# Altium project Salford Assignement21.PrjPcb
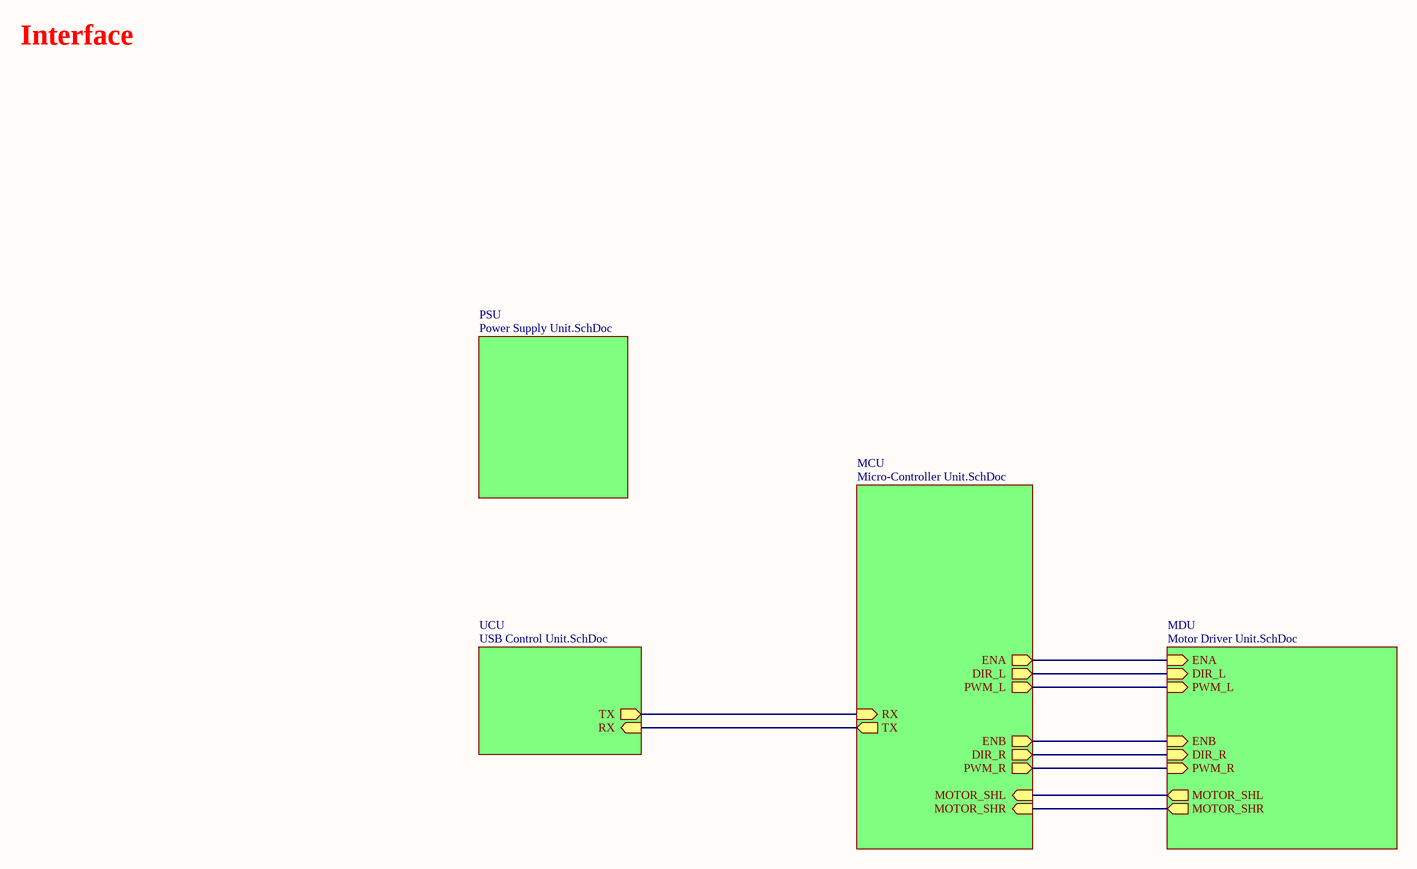
[diagram p0: Interface.SchDoc]
5 sheets, 82 parts. Net scope: hierarchical (ports join the sheet entries above them; power ports are global).
Board file: Robot Control Board.PcbDoc
Sheets:
  Interface.SchDoc
    PSU = Power Supply Unit.SchDoc
    UCU = USB Control Unit.SchDoc
    MCU = Micro-Controller Unit.SchDoc
    MDU = Motor Driver Unit.SchDoc

## Sheet Interface.SchDoc: Interface
size A3; DrawnBy: Adrien Dos SANTOS; Organization: Altium Limited; Revision: REV 1.0; SheetNumber: 1; SheetTotal: 5; ProjectName: projname

### Sub-sheets
MCU = Micro-Controller Unit.SchDoc: RX (in), TX (out), DIR_L (out), PWM_L (out), DIR_R (out), PWM_R (out), MOTOR_SHL (in), MOTOR_SHR (in), ENA (out), ENB (out)
MDU = Motor Driver Unit.SchDoc: DIR_L (in), PWM_L (in), DIR_R (in), PWM_R (in), MOTOR_SHL (out), MOTOR_SHR (out), ENA (in), ENB (in)
PSU = Power Supply Unit.SchDoc: no entries
UCU = USB Control Unit.SchDoc: TX (out), RX (in)

### Nets
NetR6_2: sheet MCU/ENA, sheet MDU/ENA
NetR7_2: sheet MCU/ENB, sheet MDU/ENB
NetR10_2: sheet MCU/MOTOR_SHL, sheet MDU/MOTOR_SHL
NetR17_2: sheet MCU/MOTOR_SHR, sheet MDU/MOTOR_SHR
NetU3_1: sheet UCU/RX, sheet MCU/TX
NetU3_5: sheet UCU/TX, sheet MCU/RX
NetU4_48: sheet MCU/DIR_R, sheet MDU/DIR_R
NetU4_49: sheet MCU/PWM_R, sheet MDU/PWM_R
NetU4_50: sheet MCU/DIR_L, sheet MDU/DIR_L
NetU4_51: sheet MCU/PWM_L, sheet MDU/PWM_L

### Notes on the sheet
- Interface
- Title
- Size:
- Date:
- A3
- Revision:
- Time:
- Sheet
- of
- Avnet EMG France SA
- 12 rue Jean Bart
- 91120 MASSY - FR
- File:
- Drawn by :

## Sheet Power Supply Unit.SchDoc: Power Supply Unit
size A3; DrawnBy: Adrien Dos SANTOS; Organization: Altium Limited; Revision: REV 1.0; SheetNumber: 4; SheetTotal: 5; ProjectName: projname
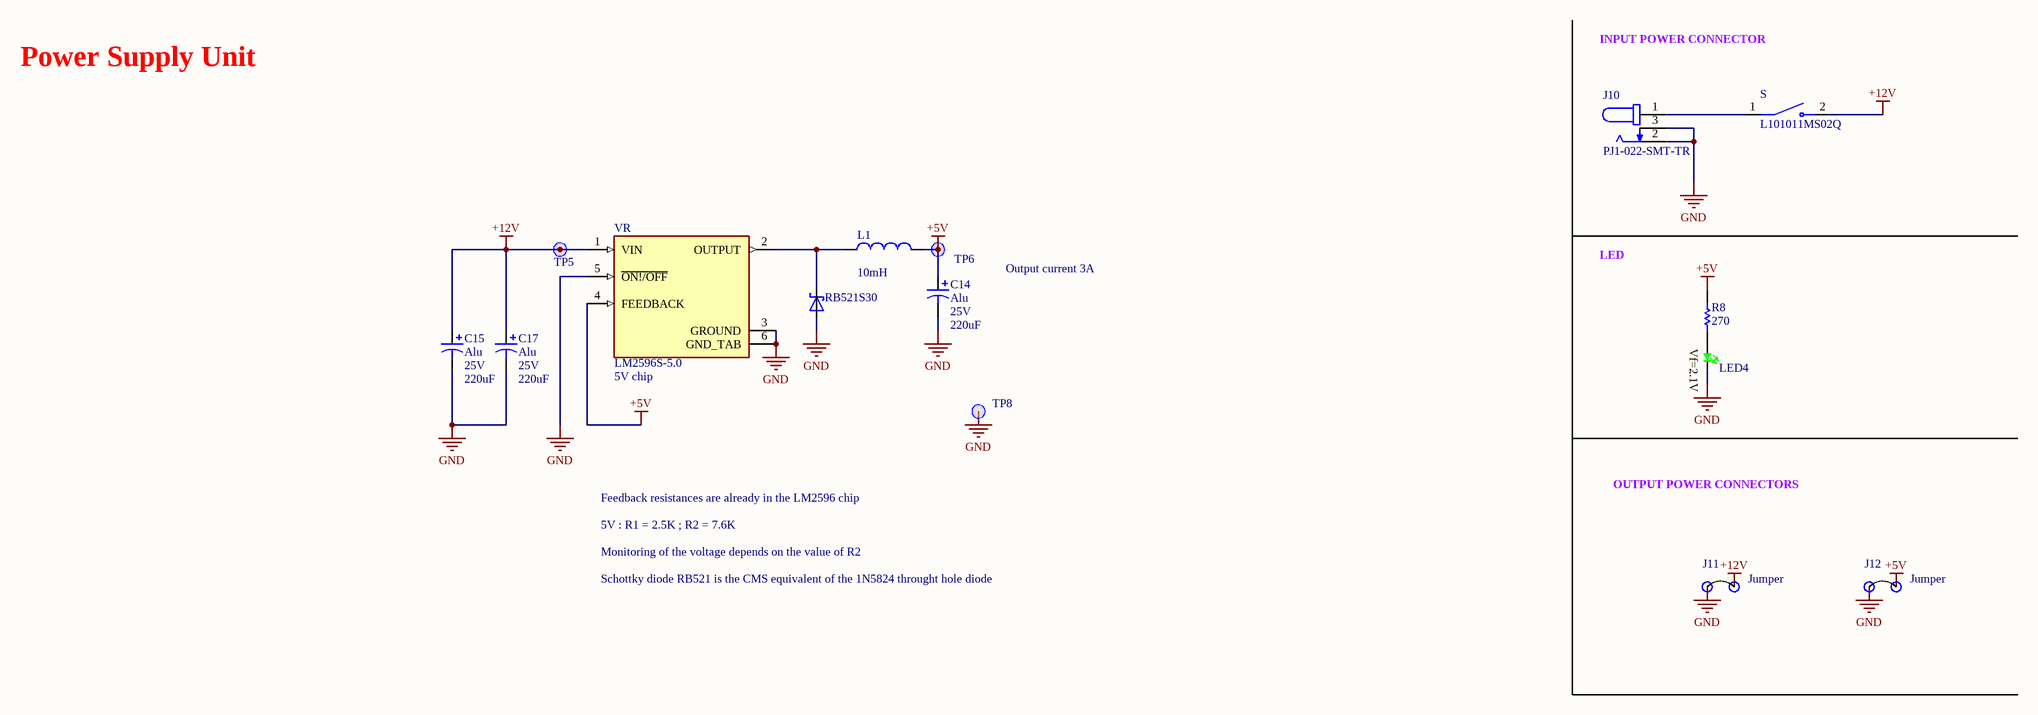
[diagram p1: Power Supply Unit.SchDoc]

### Parts
?  RB521S30  [SOD523]
C14  Alu  Voltage Rating: 25V  Capacitance: 220uF  [UUA0J471MNL1GS]
C15  Alu  Voltage Rating: 25V  Capacitance: 220uF  [UUA0J471MNL1GS]
C17  Alu  Voltage Rating: 25V  Capacitance: 220uF  [UUA0J471MNL1GS]
J10  PJ1-022-SMT-TR  [CUI_PJ1-022-SMT-TR]
J11  Jumper  [68002-102HLF]
J12  Jumper  [68002-102HLF]
L1  value 10mH  [0402-A]  (hidden comment: Inductor)
LED4  KPA-3010CGCK  [KPA-3010 GREEN]  (value not drawn)
R8  value 270  [RESC0603_N]  (hidden comment: RES)
S  L101011MS02Q  [SW_L101011MS02Q]
TP5  TEST_POINT_1.27mm  [Test_Point1.27mm]  (value not drawn)  (no BOM)
TP6  TEST_POINT_1.27mm  [Test_Point1.27mm]  (value not drawn)  (no BOM)
TP8  TEST_POINT_1.27mm  [Test_Point1.27mm]  (value not drawn)  (no BOM)
VR  LM2596S-5.0  [TO170P1524X483-6N]

### Nets
+5V: C14.1 J12.2 L1.2 R8.2 TP6.1 VR.4(FEEDBACK)
+12V: C15.1 C17.1 J11.2 S.2 TP5.1 VR.1(VIN)
GND: ?.2(A) C14.2 C15.2 C17.2 J10.2 J10.3 J11.1 J12.1 LED4.1(K) TP8.1 VR.3(GROUND) VR.5(~{ON!/OFF}) VR.6(GND_TAB)
Net?_1: ?.1(K) L1.1 VR.2(OUTPUT)
NetJ10_1: J10.1 S.1
NetLED4_2: LED4.2(A) R8.1

### Notes on the sheet
- Power Supply Unit
- INPUT POWER CONNECTOR
- Output current 3A
- LED
- (near VR) 5V chip
- Feedback resistances are already in the LM2596 chip
- OUTPUT POWER CONNECTORS
- 5V : R1 = 2.5K ; R2 = 7.6K
- Monitoring of the voltage depends on the value of R2
- Schottky diode RB521 is the CMS equivalent of the 1N5824 throught hole diode
- Title
- Size:
- Date:
- A3
- Revision:
- Time:
- Sheet
- of
- Avnet EMG France SA
- 12 rue Jean Bart
- 91120 MASSY - FR
- File:
- Drawn by :
- (in symbol KPA-3010CGCK) Vf=2.1V

### Library data of the parts
? = RB521S30: Diode Schottky 30V 200mA Surface Mount SOD-523F; MF: ON Semiconductor; Price: None; Availability: Unavailable; Package: S-9 ON Semiconductor; SnapEDA_Link: https://www.snapeda.com/parts/RB521S30/ON%20Semiconductor/view-part/1289104/?ref=snap; MP: RB521S30; Value: *
C14 C15 C17 = UUA1E221MNL1GS: CAP ALUM 220UF 20% 25V SMD; Manufacturer: Nichicon; Ripple Current: 320mA; Leakage Current: 55uA; Life (Hours): 5000Hour; Supplier 1: Digi-Key; Part Number: UUA1E221MNL1GS; Stock 1: 716; Pricing 1: 1=0,91000, 10=0,69200, 100=0,49490 (USD); RoHS: Yes; Mount: Surface Mount; Case/Package: Radial; Max Operating Temperature: 105°C; Package Quantity: 1; Tolerance: 20%; Packaging: Tape and Reel; Voltage Rating (DC): 25V; Termination: SMD/SMT; Features: General Purpose; Length: 10mm; Height - Seated (Max): 0.394inch; ComponentLink1URL: https://datasheet.ciiva.com/15036/e-ua-15036879.pdf?src-supplier=Digi-Key; ComponentLink1Description: https://datasheet.ciiva.com/15036/e-ua-15036879.pdf?src-supplier=Digi-Key; Supplier Part Number 1: 493-9451-1-ND; Currency: *; MOQ: *; Avnet part number: *
J10 = PJ1-022-SMT-TR: 0.65 x 2.8 mm, 2.5 A, Horizontal, Surface Mount _SMT_, Dc Power Jack Connector; MF: CUI Devices; SnapEDA_Link: https://www.snapeda.com/parts/PJ1-022-SMT-TR/CUI%20Devices/view-part/491023/?ref=snap; MP: PJ1-022-SMT-TR; Availability: Unavailable; Package: MSOP-8; Price: None; Value: *
J11 J12 = 68002-102HLF JMP: JUMPER Headers 2POS 2.54mm pitch for jumper; Manufacturer: Amphenol FCI; Number of Contacts: 2; Current Rating: 3A; Voltage Rating: 1.5kV; Insulation Resistance: 5GR; Gender: Male; Connector Type: Male Pin; Contact Post Length: 3.81mm; Supplier 1: Digi-Key; Part Number: 68002-102HLF; RoHS: Yes; Category: Board to Board Connectors; Stock 1: 4863; Pricing 1: 1=0,33000, 10=0,31600, 100=0,22120, 500=0,18964, 1000=0,15803, 5000=0,13545, 10000=0,12642 (USD); Mount: Through Hole; Contact Plating: Gold,GXT; Contact Material: Bronze; Color: Black; Housing Color: Black; Housing Material: Thermoplastic; Min Operating Temperature: -65°C; Max Operating Temperature: 125°C; Number of Rows: 1; Termination: Solder; Packaging: Bulk; Contact Gender: Male; Package Quantity: 100; Number of Positions: 2; Max Voltage Rating (AC): 1.5kV; Orientation: Straight; Length: 5.08mm; Pitch: 2.54mm; Contact Mating Length: 0.23inch; Depth: 2.41mm; Radiation Hardening: No; Lead Free: Lead Free; Flammability Rating: UL94 V-0; ComponentLink1URL: https://datasheet.ciiva.com/16726/68000-16726189.pdf?src-supplier=Avnet+Europe; ComponentLink1Description: https://datasheet.ciiva.com/16726/68000-16726189.pdf?src-supplier=Avnet+Europe; ComponentLink2URL: https://datasheet.ciiva.com/721/68000-721356.pdf?src-supplier=Digi-Key; ComponentLink2Description: https://datasheet.ciiva.com/721/68000-721356.pdf?src-supplier=Digi-Key
L1 = Inductor: Code_IEC: 1005; Published: 8-Jun-2000; LatestRevisionDate: 29-May-2009; LatestRevisionNote: IPC-7351 Footprint Added.; PackageReference: 0402-A; Publisher: Altium Limited; PackageDescription: Chip Inductor; Code_JEITA: 0402
LED4 = KPA-3010CGCK: 3.0 mm x 1.0 mm Green Right Angle SMD Chip LED Lamp 120°; Manufacturer: Kingbright; Part Number: APA3010CGCK; Lens Style: Clear; Dominant Wavelength: 570nm; Forward Voltage: 2.1V; Luminous Intensity: 60mcd; Test Current: 20mA; Supplier 1: Digi-Key; Stock 1: 0; Pricing 1: 2000=0.1155 (USD); Mount: Surface Mount; Case/Package: SMD/SMT; Colour: Green; Viewing Angle: 120°; Packaging: Tape and Reel; Package Quantity: 2000; Length: 3mm; Height: 1mm; Width: 2mm; Lead Free: Lead Free; Supplier Part Number 1: 754-1063-2-ND
R8 = RT0603BRE07270RL: RES 270 OHM 1/10W .1% SMD 0603; manufacturer: Yageo; currency: USD; Rated Power: 0.1W, 1/10W; smt_res_0603id: 163901; sub_category_id: 619; category_id: 33; Temperature Coefficient: ±50ppm/°C; Tolerance: ±0.1%; lead_style: Surface Mount (SMD - SMT); Value Unit: 1; MOQ: 5.000; Part Number: RT0603BRE07270RL; price: 0.11300; image: http://media.digikey.com/Renders/Yageo%20Renders/RC0603FR-0710RL_tmb.jpg; Digikey PN: RT0603BRE07270RL-ND; series: RT; composition: Thin Film; features: -; Case: 0603 (1608 metric); Size Dimension: 0.063" L x 0.031" W (1.60mm x 0.80mm); Height: 0.018" (0.45mm); packaging: Tape & Reel (TR); quantity_available: 0; datasheet: http://www.yageo.com/pdf/PYu-RT_1-to-0.05_RoHS_L_3.pdf; Normalized Value: 270; Display Value: 270; Value_in_ohm: 270
S = L101011MS02Q: Slide Switch SPST Through Hole; MF: C&K; MP: L101011MS02Q; Value: *; Availability: Unavailable; SnapEDA_Link: https://www.snapeda.com/parts/L101011MS02Q/C%26K/view-part/455586/?ref=snap; Price: None; Package: None
VR = LM2596S-5.0: SIMPLE SWITCHER&reg; 4.5V to 40V, 3A Low Component Count Step-Down Regulator 5-DDPAK/TO-263; MF: Texas Instruments; MP: LM2596S-5.0/NOPB; DigiKey-Purchase-URL: https://snapeda.com/shop?store=DigiKey&id=15588; Mouser-Purchase-URL: https://snapeda.com/shop?store=Mouser&id=15588; SnapEDA_Link: https://www.snapeda.com/parts/LM2596S-5.0/NOPB/Texas%20Instruments/view-part/15588/?ref=snap; Price: None; Value: *; Availability: Good; Texas_Instruments-Purchase-URL: https://snapeda.com/shop?store=Texas+Instruments&id=15588; Package: TO-263-5 Texas Instruments

## Sheet USB Control Unit.SchDoc: USB Control Unit
size A3; DrawnBy: Adrien Dos SANTOS; Organization: Altium Limited; Revision: REV 1.0; SheetNumber: 5; SheetTotal: 5; ProjectName: projname
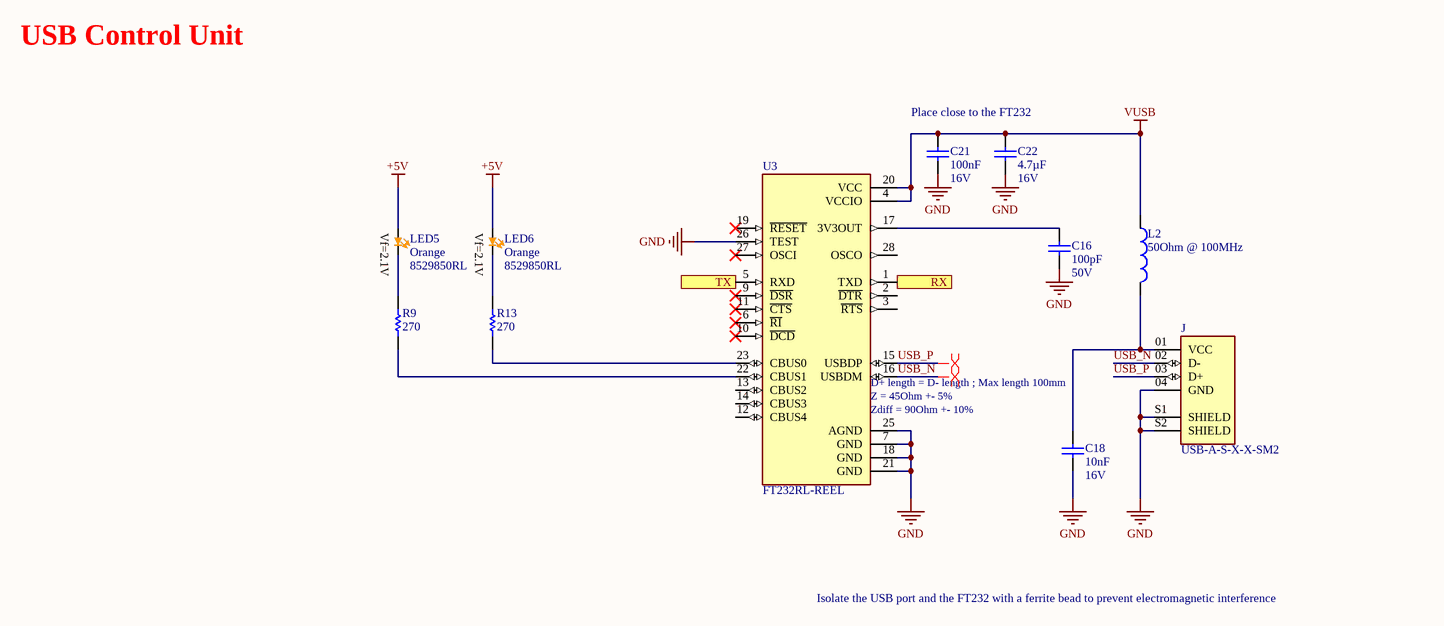
[diagram p2: USB Control Unit.SchDoc]

### Parts
C16  value 100pF  Voltage - Rated: 50V  [CC0201 x 0.33mm]  (hidden comment: CAP)
C18  value 10nF  Voltage - Rated: 16V  [CC0603 x 0.95mm]  (hidden comment: CAP)
C21  value 100nF  Voltage - Rated: 16V  [CC0603 x 0.90mm]  (hidden comment: CAP)
C22  value 4.7µF  Voltage - Rated: 16V  [CC0603 x 0.95mm]  (hidden comment: CAP)
J  USB-A-S-X-X-SM2  [SAMTEC_USB-A-S-X-X-SM2]
L2  50Ohm @ 100MHz  [MMZ1608D500CTDH5]
LED5  Orange  Supplier Part Number 1: 8529850RL  [LED 0603 ORANGE]
LED6  Orange  Supplier Part Number 1: 8529850RL  [LED 0603 ORANGE]
R9  value 270  [RESC0603_N]  (hidden comment: RES)
R13  value 270  [RESC0603_N]  (hidden comment: RES)
U3  FT232RL-REEL  [SOP65P780X200-28N]

### Ports
RX (out), TX (in)

### Nets
+5V: LED5.2(A) LED6.2(A)
GND: C16.1 C18.1 C21.1 C22.1 J.04(GND) J.S1(SHIELD) J.S2(SHIELD) U3.7(GND) U3.18(GND) U3.21(GND) U3.25(AGND) U3.26(TEST)
VUSB: C21.2 C22.2 L2.1 U3.4(VCCIO) U3.20(VCC)
USB_N: J.02(D-) U3.16(USBDM)
USB_P: J.03(D+) U3.15(USBDP)
NetC16_2: C16.2 U3.17(3V3OUT)
NetC18_2: C18.2 J.01(VCC) L2.2
NetLED5_1: LED5.1(K) R9.2
NetLED6_1: LED6.1(K) R13.2
NetR9_1: R9.1 U3.22(CBUS1)
NetR13_1: R13.1 U3.23(CBUS0)
NetU3_1: U3.1(TXD) ; port RX
NetU3_5: U3.5(RXD) ; port TX

Not connected (* = marked no-connect by the designer): U3 2(~{DTR}) 3(~{RTS}) 6(~{RI})* 9(~{DSR})* 10(~{DCD})* 11(~{CTS})* 12(CBUS4) 13(CBUS2) 14(CBUS3) 19(~{RESET})* 27(OSCI)* 28(OSCO)

### Layout directives
differential pair; differential pair class USB: USB_N, USB_P

### Notes on the sheet
- USB Control Unit
- Place close to the FT232
- (near U3) D+ length = D- length ; Max length 100mm
- (near U3) Z = 45Ohm +- 5%
- (near U3) Zdiff = 90Ohm +- 10%
- Isolate the USB port and the FT232 with a ferrite bead to prevent electromagnetic interference
- Title
- Size:
- Date:
- A3
- Revision:
- Time:
- Sheet
- of
- Avnet EMG France SA
- 12 rue Jean Bart
- 91120 MASSY - FR
- File:
- Drawn by :
- (in symbol KP-1608SECK) Vf=2.1V

### Library data of the parts
C16 = GRM0335C1H101GA01D: 100pF ±2% 50V Ceramic Capacitor C0G, NP0 0201 (0603 Metric); manufacturer: Murata Electronics; Manufacturer Standard Lead Time: 11 Weeks; currency: USD; idx: 118; Package Inch: 0201; Package Metric: 0603; Normalized value µF: 0.0001; Part Number: GRM0335C1H101GA01D; price: *; Rated Voltage: *; Tolerance: ±2%; Temperature Coefficient: C0G, NP0; MOQ: *; ComponentLink1URL: https://search.murata.co.jp/Ceramy/image/img/A01X/G101/ENG/GRM0335C1H101GA01-01.pdf; ProductLink: https://www.digikey.com/product-detail/en/murata-electronics/GRM0335C1H101GA01D/490-7751-2-ND/4358135; Digi-Key Part Number: 490-7751-2-ND; Operating Temperature: -55°C ~ 125°C; Lead Free Status / RoHS Status: Lead free / ROHS3 Compliant; Mounting Type: Surface Mount, MLCC; Size / Dimension: 0.024" L x 0.012" W (0.60mm x 0.30mm); Thickness (Max): 0.013" (0.33mm); Thickness mm: 0.33; Thickness Inch: 0.013; Length Inch: 0.024; Width Inch: 0.012; Length mm: 0.60; Width mm: 0.30; Series: GRM; Part Status: Active; Package / Case: 0201 (0603 Metric); Lead Style: -; Packaging: Tape & Reel (TR); Moisture Sensitivity Level (MSL): 1  (Unlimited); ComponentLink1Description: Datasheet; Applications: General Purpose; Height - Seated (Max): -; Lead Spacing: -; Capacitance: 100pF; Features: -; Ratings: -
C18 = CS0603KRX7R7BB103: 10000pF ±10% 16V Ceramic Capacitor X7R 0603 (1608 Metric); manufacturer: Yageo; Manufacturer Standard Lead Time: 17 Weeks; currency: USD; idx: 48811; Package Inch: 0603; Package Metric: 1608; Normalized value µF: 0.01; Part Number: CS0603KRX7R7BB103; price: *; Rated Voltage: *; Tolerance: ±10%; Temperature Coefficient: X7R; MOQ: *; ComponentLink1URL: http://www.yageo.com/NewPortal/yageodocoutput?fileName=/pdf/MLCC/UPY-ST_NPOX7R_16V-to-3KV_5.pdf; ProductLink: https://www.digikey.com/product-detail/en/yageo/CS0603KRX7R7BB103/CS0603KRX7R7BB103-ND/6097905; Digi-Key Part Number: CS0603KRX7R7BB103-ND; Operating Temperature: -55°C ~ 125°C; Lead Free Status / RoHS Status: Lead free / ROHS3 Compliant; Mounting Type: Surface Mount, MLCC; Size / Dimension: 0.063" L x 0.031" W (1.60mm x 0.80mm); Thickness (Max): 0.037" (0.95mm); Thickness mm: 0.95; Thickness Inch: 0.037; Length Inch: 0.063; Width Inch: 0.031; Length mm: 1.60; Width mm: 0.80; Series: CS; Part Status: Active; Package / Case: 0603 (1608 Metric); Lead Style: -; Packaging: Tape & Reel (TR); Moisture Sensitivity Level (MSL): 1  (Unlimited); Applications: Boardflex Sensitive; Height - Seated (Max): -; Lead Spacing: -; Capacitance: 10000pF; Features: Soft Termination; Ratings: -; Failure Rate: -
C21 = CC0603KRX7R7BB104: 0.1µF ±10% 16V Ceramic Capacitor X7R 0603 (1608 Metric); manufacturer: Yageo; Manufacturer Standard Lead Time: 16 Weeks; currency: USD; idx: 766; Package Inch: 0603; Package Metric: 1608; Normalized value µF: 0.1; Part Number: CC0603KRX7R7BB104; price: *; Rated Voltage: *; Tolerance: ±10%; Temperature Coefficient: X7R; MOQ: *; ComponentLink1URL: https://www.yageo.com/upload/media/product/productsearch/datasheet/mlcc/UPY-GPHC_X7R_6.3V-to-50V_18.pdf; ProductLink: https://www.digikey.com/product-detail/en/yageo/CC0603KRX7R7BB104/311-1088-2-ND/302822; Digi-Key Part Number: 311-1088-2-ND; Operating Temperature: -55°C ~ 125°C; Lead Free Status / RoHS Status: Lead free / ROHS3 Compliant; Mounting Type: Surface Mount, MLCC; Size / Dimension: 0.063" L x 0.031" W (1.60mm x 0.80mm); Thickness (Max): 0.035" (0.90mm); Thickness mm: 0.90; Thickness Inch: 0.035; Length Inch: 0.063; Width Inch: 0.031; Length mm: 1.60; Width mm: 0.80; Series: CC; Part Status: Active; Package / Case: 0603 (1608 Metric); Lead Style: -; Packaging: Tape & Reel (TR); Moisture Sensitivity Level (MSL): 1  (Unlimited); Applications: General Purpose; Height - Seated (Max): -; Lead Spacing: -; Capacitance: 0.1µF; Features: -; Ratings: -; Failure Rate: -
C22 = CC0603KRX5R7BB475: 4.7µF ±10% 16V Ceramic Capacitor X5R 0603 (1608 Metric); manufacturer: Yageo; currency: USD; idx: 4886; Package Inch: 0603; Package Metric: 1608; Normalized value µF: 4.7; Part Number: CC0603KRX5R7BB475; price: *; Rated Voltage: *; Tolerance: ±10%; Temperature Coefficient: X5R; MOQ: *; ComponentLink1URL: https://www.yageo.com/upload/media/product/productsearch/datasheet/mlcc/UPY-GPHC_X5R_4V-to-50V_25.pdf; ProductLink: https://www.digikey.com/product-detail/en/yageo/CC0603KRX5R7BB475/311-1785-2-ND/5195193; Digi-Key Part Number: 311-1785-2-ND; Operating Temperature: -55°C ~ 85°C; Lead Free Status / RoHS Status: Lead free / ROHS3 Compliant; Mounting Type: Surface Mount, MLCC; Size / Dimension: 0.063" L x 0.031" W (1.60mm x 0.80mm); Thickness (Max): 0.037" (0.95mm); Thickness mm: 0.95; Thickness Inch: 0.037; Length Inch: 0.063; Width Inch: 0.031; Length mm: 1.60; Width mm: 0.80; Series: CC; Part Status: Active; Package / Case: 0603 (1608 Metric); Lead Style: -; Packaging: Tape & Reel (TR); Moisture Sensitivity Level (MSL): 1  (Unlimited); Applications: General Purpose; Height - Seated (Max): -; Lead Spacing: -; Capacitance: 4.7µF; Features: -; Ratings: -; Failure Rate: -
J = USB-A-S-X-X-SM2: USB-A (USB TYPE-A) USB 2.0 Receptacle Connector 4 Position Surface Mount, Right Angle; MP: USB-A-S-F-B-SM2; MF: Samtec; SnapEDA_Link: https://www.snapeda.com/parts/USB-A-S-F-B-SM2/Samtec%20Inc./view-part/937545/?ref=snap; Value: *; Availability: Unavailable; DigiKey-Purchase-URL: https://snapeda.com/shop?store=DigiKey&id=937545; Package: None; Toby_UK-Purchase-URL: https://snapeda.com/shop?store=Toby+UK&id=937545; Price: None
L2 = MMZ1608D500CTDH5
LED5 LED6 = KP-1608SECK: 1.6 mm x 0.8 mm Orange SMD Top LED; Manufacturer: Kingbright; currency: EUR; Lens Colour: Clear; Viewing Angle: 120°; Lens Style: Diffused,Colorless,Rectangular; Wavelength: 601nm; Luminous Intensity: 250mcd; Forward Voltage: 2.1V; Forward Current: 30mA; Number of LEDs: 1; Power Dissipation: 75mW; Avnet Part Number: KINKPG1608SEKCT; Price: 0.0296; MOQ: 2000; ComponentLink1URL: https://datasheet.ciiva.com/8060/1655842-8060422.pdf; ComponentLink1Description: https://datasheet.ciiva.com/8060/1655842-8060422.pdf; ComponentLink2URL: https://datasheet.ciiva.com/41454/001050379-da-01-en-smd-chipled-bl-0603-kp-1608qbc-d-41454603.pdf; ComponentLink2Description: https://datasheet.ciiva.com/41454/001050379-da-01-en-smd-chipled-bl-0603-kp-1608qbc-d-41454603.pdf; Supplier 1: Element14; Part Number: KP-1608SECK; Stock 1: 0; Case/Package: 1608; Number of Pins: 2; Colour: Orange; Packaging: Cut Tape; Dominant Wavelength: 601nm; Length: 0.8mm; Height: 1.1mm; Width: 1.6mm; Radiation Hardening: No; REACH SVHC: No SVHC; ComponentLink3URL: https://datasheet.ciiva.com/8060/1701685-8060423.pdf; ComponentLink3Description: https://datasheet.ciiva.com/8060/1701685-8060423.pdf; ComponentLink4URL: https://datasheet.ciiva.com/20166/72-4726-20166919.pdf; ComponentLink4Description: https://datasheet.ciiva.com/20166/72-4726-20166919.pdf; ComponentLink5URL: https://datasheet.ciiva.com/20166/72-4730-20166961.pdf; ComponentLink5Description: https://datasheet.ciiva.com/20166/72-4730-20166961.pdf; ComponentLink6URL: https://datasheet.ciiva.com/8060/1701685-8060424.pdf; ComponentLink6Description: https://datasheet.ciiva.com/8060/1701685-8060424.pdf; ComponentLink7URL: https://datasheet.ciiva.com/46397/1701685-46397813.pdf; ComponentLink7Description: https://datasheet.ciiva.com/46397/1701685-46397813.pdf
R9 R13 = RT0603BRE07270RL: as R8 on sheet Power Supply Unit; MOQ: 5.000; Part Number: RT0603BRE07270RL; price: 0.11300; image: http://media.digikey.com/Renders/Yageo%20Renders/RC0603FR-0710RL_tmb.jpg; Digikey PN: RT0603BRE07270RL-ND; series: RT; composition: Thin Film; features: -; Case: 0603 (1608 metric); Size Dimension: 0.063" L x 0.031" W (1.60mm x 0.80mm); Height: 0.018" (0.45mm); packaging: Tape & Reel (TR); quantity_available: 0; datasheet: http://www.yageo.com/pdf/PYu-RT_1-to-0.05_RoHS_L_3.pdf; Normalized Value: 270; Display Value: 270; Value_in_ohm: 270
U3 = FT232RL-REEL: USB Bridge, USB to UART USB 2.0 UART Interface 28-SSOP; MF: FTDI,; MP: FT232RL-REEL; Package: SSOP-28 FTDI; SnapEDA_Link: https://www.snapeda.com/parts/FT232RL-REEL/FTDI,%20Future%20Technology%20Devices%20International%20Ltd/view-part/45427/?ref=snap; Value: *; Check_prices: https://www.snapeda.com/parts/FT232RL-REEL/FTDI,%20Future%20Technology%20Devices%20International%20Ltd/view-part/45427/?ref=eda; Purchase-URL: https://pricing.snapeda.com/search/part/FT232RL-REEL/?ref=eda; Digi-Key_Part_Number: 768-1007-1-ND

## Sheet Micro-Controller Unit.SchDoc: Micro Controller Unit
size A3; DrawnBy: Adrien Dos SANTOS; Organization: Altium Limited; Revision: revision; SheetNumber: 2; SheetTotal: 5; ProjectName: projname
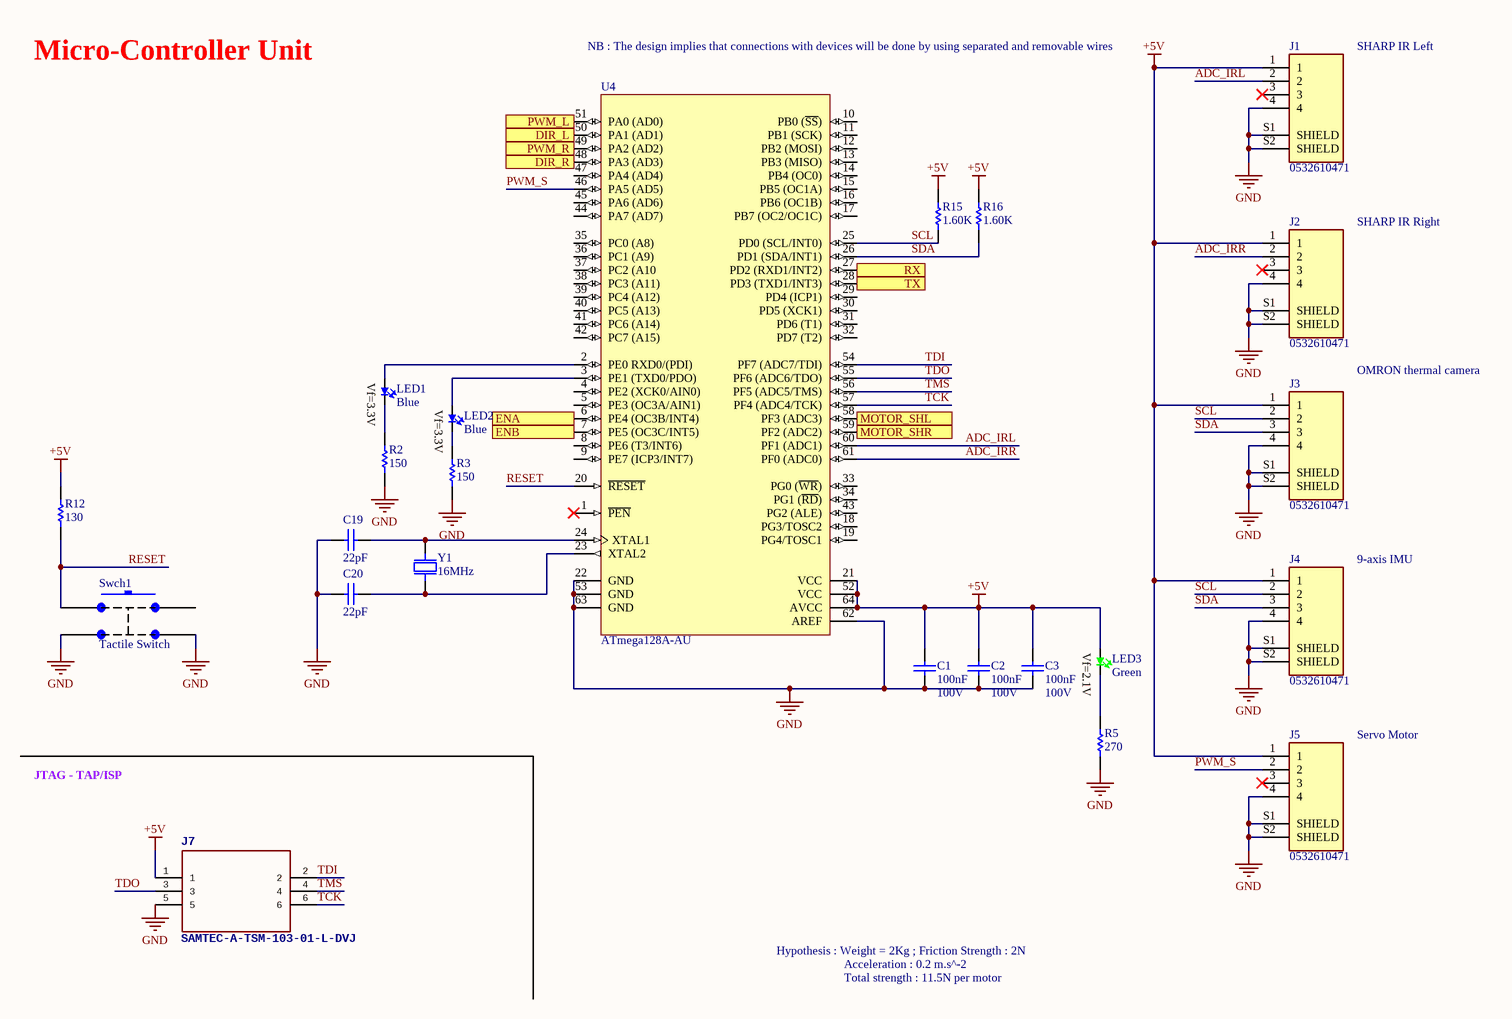
[diagram p3: Micro-Controller Unit.SchDoc]

### Parts
C1  value 100nF  Voltage - Rated: 100V  [CC0603 x 0.95mm]  (hidden comment: CAP)
C2  value 100nF  Voltage - Rated: 100V  [CC0603 x 0.95mm]  (hidden comment: CAP)
C3  value 100nF  Voltage - Rated: 100V  [CC0603 x 0.95mm]  (hidden comment: CAP)
C19  value 22pF  [CC0201 x 0.33mm]  (hidden comment: CAP)
C20  value 22pF  [CC0201 x 0.33mm]  (hidden comment: CAP)
J1  0532610471  [MOLEX_0532610471]
J2  0532610471  [MOLEX_0532610471]
J3  0532610471  [MOLEX_0532610471]
J4  0532610471  [MOLEX_0532610471]
J5  0532610471  [MOLEX_0532610471]
J7  SAMTEC-A-TSM-103-01-L-DVJ  [SAMTEC-A-TSM-103-01-L-DV]
LED1  Blue  [LED 0603 WHITE]
LED2  Blue  [LED 0603 WHITE]
LED3  Green  [LED 0603 GREEN]
R2  value 150  [RESC0603_N]  (hidden comment: RES)
R3  value 150  [RESC0603_N]  (hidden comment: RES)
R5  value 270  [RESC0603_N]  (hidden comment: RES)
R12  value 130  [RESC0603_N]  (hidden comment: RES)
R15  value 1.60K  [RESC0603_N]  (hidden comment: RES)
R16  value 1.60K  [RESC0603_N]  (hidden comment: RES)
Swch1  Tactile Switch  [Tactile Switch - 1825910_6]
U4  ATmega128A-AU  [64A_N]
Y1  16MHz  [ABM3]

### Ports
DIR_L (out), DIR_R (out), ENA (out), ENB (out), MOTOR_SHL (in), MOTOR_SHR (in), PWM_L (out), PWM_R (out), RX (in), TX (out)

### Nets
+5V: C1.2 C2.2 C3.2 J1.1 J2.1 J3.1 J4.1 J5.1 J7.1 LED3.2(A) R12.2 R15.2 R16.2 U4.21(VCC) U4.52(VCC) U4.64(AVCC)
GND: C1.1 C2.1 C3.1 C19.1 C20.1 J1.4 J1.S1(SHIELD) J1.S2(SHIELD) J2.4 J2.S1(SHIELD) J2.S2(SHIELD) J3.4 J3.S1(SHIELD) J3.S2(SHIELD) J4.4 J4.S1(SHIELD) J4.S2(SHIELD) J5.4 J5.S1(SHIELD) J5.S2(SHIELD) J7.5 R2.1 R3.1 R5.1 Swch1.3(out) Swch1.4(out) U4.22(GND) U4.53(GND) U4.62(AREF) U4.63(GND)
ADC_IRL: J1.2 U4.60(PF1_(ADC1))
ADC_IRR: J2.2 U4.61(PF0_(ADC0))
PWM_S: J5.2 U4.46(PA5_(AD5))
RESET: R12.1 Swch1.1(in) U4.20(~{RESET})
SCL: J3.2 J4.2 R15.1 U4.25(PD0_(SCL/INT0))
SDA: J3.3 J4.3 R16.1 U4.26(PD1_(SDA/INT1))
TCK: J7.6 U4.57(PF4_(ADC4/TCK))
TDI: J7.2 U4.54(PF7_(ADC7/TDI))
TDO: J7.3 U4.55(PF6_(ADC6/TDO))
TMS: J7.4 U4.56(PF5_(ADC5/TMS))
NetC19_2: C19.2 U4.24(XTAL1) Y1.2
NetC20_2: C20.2 U4.23(XTAL2) Y1.1
NetLED1_1: LED1.1(K) R2.2
NetLED1_2: LED1.2(A) U4.2(PE0_RXD0/(PDI))
NetLED2_1: LED2.1(K) R3.2
NetLED2_2: LED2.2(A) U4.3(PE1_(TXD0/PDO))
NetLED3_1: LED3.1(K) R5.2
NetR6_2: U4.6(PE4_(OC3B/INT4)) ; port ENA
NetR7_2: U4.7(PE5_(OC3C/INT5)) ; port ENB
NetR10_2: U4.58(PF3_(ADC3)) ; port MOTOR_SHL
NetR17_2: U4.59(PF2_(ADC2)) ; port MOTOR_SHR
NetU3_1: U4.28(PD3_(TXD1/INT3)) ; port TX
NetU3_5: U4.27(PD2_(RXD1/INT2)) ; port RX
NetU4_48: U4.48(PA3_(AD3)) ; port DIR_R
NetU4_49: U4.49(PA2_(AD2)) ; port PWM_R
NetU4_50: U4.50(PA1_(AD1)) ; port DIR_L
NetU4_51: U4.51(PA0_(AD0)) ; port PWM_L

Not connected (* = marked no-connect by the designer): J1 3*; J2 3*; J5 3*; Swch1 2(in); U4 1(~{PEN})* 4(PE2_(XCK0/AIN0)) 5(PE3_(OC3A/AIN1)) 8(PE6_(T3/INT6)) 9(PE7_(ICP3/INT7)) 10(PB0_(~{SS})) 11(PB1_(SCK)) 12(PB2_(MOSI)) 13(PB3_(MISO)) 14(PB4_(OC0)) 15(PB5_(OC1A)) 16(PB6_(OC1B)) 17(PB7_(OC2/OC1C)) 18(PG3/TOSC2) 19(PG4/TOSC1) 29(PD4_(ICP1)) 30(PD5_(XCK1)) 31(PD6_(T1)) 32(PD7_(T2)) 33(PG0_(~{WR})) 34(PG1_(~{RD})) 35(PC0_(A8)) 36(PC1_(A9)) 37(PC2_(A10) 38(PC3_(A11)) 39(PC4_(A12)) 40(PC5_(A13)) 41(PC6_(A14)) 42(PC7_(A15)) 43(PG2_(ALE)) 44(PA7_(AD7)) 45(PA6_(AD6)) 47(PA4_(AD4))

### Notes on the sheet
- Micro-Controller Unit
- NB : The design implies that connections with devices will be done by using separated and removable wires
- SHARP IR Left
- SHARP IR Right
- OMRON thermal camera
- 9-axis IMU
- JTAG - TAP/ISP
- Servo Motor
- Hypothesis : Weight = 2Kg ; Friction Strength : 2N
- Acceleration : 0.2 m.s^-2
- Total strength : 11.5N per motor
- Title
- Size:
- Date:
- A3
- Revision:
- Time:
- Sheet
- of
- Avnet EMG France SA
- 12 rue Jean Bart
- 91120 MASSY - FR
- File:
- Drawn by :
- (in symbol KP-1608CGCK) Vf=2.1V
- (in symbol KP-1608QBC-D) Vf=3.3V

### Library data of the parts
C1-C3 = CS0603KRX7R0BB104: 0.1µF ±10% 100V Ceramic Capacitor X7R 0603 (1608 Metric); manufacturer: Yageo; Manufacturer Standard Lead Time: 17 Weeks; currency: USD; idx: 2943; Package Inch: 0603; Package Metric: 1608; Normalized value µF: 0.1; Part Number: CS0603KRX7R0BB104; price: *; Rated Voltage: *; Tolerance: ±10%; Temperature Coefficient: X7R; MOQ: *; ComponentLink1URL: http://www.yageo.com/NewPortal/yageodocoutput?fileName=/pdf/MLCC/UPY-ST_NPOX7R_16V-to-3KV_5.pdf; ProductLink: https://www.digikey.com/product-detail/en/yageo/CS0603KRX7R0BB104/311-3555-2-ND/6097976; Digi-Key Part Number: 311-3555-2-ND; Operating Temperature: -55°C ~ 125°C; Lead Free Status / RoHS Status: Lead free / ROHS3 Compliant; Mounting Type: Surface Mount, MLCC; Size / Dimension: 0.063" L x 0.031" W (1.60mm x 0.80mm); Thickness (Max): 0.037" (0.95mm); Thickness mm: 0.95; Thickness Inch: 0.037; Length Inch: 0.063; Width Inch: 0.031; Length mm: 1.60; Width mm: 0.80; Series: CS; Part Status: Active; Package / Case: 0603 (1608 Metric); Lead Style: -; Packaging: Tape & Reel (TR); Moisture Sensitivity Level (MSL): 1  (Unlimited); Applications: Boardflex Sensitive; Height - Seated (Max): -; Lead Spacing: -; Capacitance: 0.1µF; Features: Soft Termination; Ratings: -; Failure Rate: -
C19 C20 = CC0201GRNPO9BN220: 22pF ±2% 50V Ceramic Capacitor C0G, NP0 0201 (0603 Metric); manufacturer: Yageo; Manufacturer Standard Lead Time: 17 Weeks; currency: USD; idx: 21136; Package Inch: 0201; Package Metric: 0603; Normalized value µF: 2.2E-5; Part Number: CC0201GRNPO9BN220; price: *; Rated Voltage: *; Tolerance: ±2%; Temperature Coefficient: C0G, NP0; MOQ: *; Voltage - Rated: 50V; ComponentLink1URL: https://www.yageo.com/upload/media/product/productsearch/datasheet/mlcc/UPY-GP_NP0_16V-to-50V_17.pdf; ProductLink: https://www.digikey.com/product-detail/en/yageo/CC0201GRNPO9BN220/311-3681-2-ND/5883130; Digi-Key Part Number: 311-3681-2-ND; Operating Temperature: -55°C ~ 125°C; Lead Free Status / RoHS Status: Lead free / ROHS3 Compliant; Mounting Type: Surface Mount, MLCC; Size / Dimension: 0.024" L x 0.012" W (0.60mm x 0.30mm); Thickness (Max): 0.013" (0.33mm); Thickness mm: 0.33; Thickness Inch: 0.013; Length Inch: 0.024; Width Inch: 0.012; Length mm: 0.60; Width mm: 0.30; Series: CC; Part Status: Active; Package / Case: 0201 (0603 Metric); Lead Style: -; Packaging: Tape & Reel (TR); Moisture Sensitivity Level (MSL): 1  (Unlimited); ComponentLink1Description: Datasheet; Applications: General Purpose; Height - Seated (Max): -; Lead Spacing: -; Capacitance: 22pF; Features: -; Ratings: -; Failure Rate: -
J1-J5 = 0532610471: Picoblade Connector, 4 Circuit Single Row, Right Angle Surface Mount SMT PCB; MF: Molex; MP: 0532610471; Digi-Key_Purchase_URL: https://www.digikey.com/product-detail/en/molex/0532610471/WM7622CT-ND/699109?utm_source=snapeda&utm_medium=aggregator&utm_campaign=symbol; Package: None; Digi-Key_Part_Number: WM7622CT-ND; Value: *; SnapEDA_Link: https://www.snapeda.com/parts/0532610471/Molex/view-part/542805/?ref=snap
LED1 LED2 = KP-1608QBC-D: 1.6 mm x 0.8 mm Blue SMD Top LED; Manufacturer: Kingbright; currency: EUR; Lens Colour: Clear; Viewing Angle: 120°; Lens Style: Diffused,Colorless,Circular,Rectangular; Number of LEDs: 1; Wavelength: 465nm; Luminous Intensity: 100mcd; Forward Voltage: 3.3V; Dominant Wavelength: 470nm; Forward Current: 20mA; Avnet Part Number: KINKP1608QBCD; Price: 0.0419; MOQ: 2000; Supplier 1: Element14; Part Number: KP-1608QBC-D; Stock 1: 2000; Mount: Surface Mount; Case/Package: 1608; Number of Pins: 2; Colour: Blue; Packaging: Tape and Reel; Length: 0.8mm; Height: 1.1mm; Width: 1.6mm; Radiation Hardening: No; REACH SVHC: No SVHC; ComponentLink1URL: https://datasheet.ciiva.com/8060/1655842-8060422.pdf; ComponentLink1Description: https://datasheet.ciiva.com/8060/1655842-8060422.pdf; ComponentLink2URL: https://datasheet.ciiva.com/41454/001050379-da-01-en-smd-chipled-bl-0603-kp-1608qbc-d-41454603.pdf; ComponentLink2Description: https://datasheet.ciiva.com/41454/001050379-da-01-en-smd-chipled-bl-0603-kp-1608qbc-d-41454603.pdf; Supplier Part Number 1: 2449779
LED3 = KP-1608CGCK: 1.6 mm x 0.8 mm Green SMD Top LED; Manufacturer: Kingbright; Lens Colour: Clear; Viewing Angle: 120°; Lens Style: Diffused,Colorless,Rectangular; Dominant Wavelength: 570nm; Number of LEDs: 1; Luminous Intensity: 50mcd; Forward Voltage: 2.1V; Forward Current: 20mA; currency: EUR; Supplier 1: Element14; Part Number: KP-1608CGCK; Stock 1: 0; Mount: Surface Mount; Case/Package: 1608; Number of Pins: 2; Colour: Green; Wavelength: 570nm; Packaging: Tape and Reel; Length: 0.8mm; Height: 1.1mm; Width: 1.6mm; Radiation Hardening: No; REACH SVHC: No SVHC; ComponentLink1URL: https://datasheet.ciiva.com/8060/1683493-8060417.pdf; ComponentLink1Description: https://datasheet.ciiva.com/8060/1683493-8060417.pdf; ComponentLink2URL: https://datasheet.ciiva.com/20166/72-8670-20166923.pdf; ComponentLink2Description: https://datasheet.ciiva.com/20166/72-8670-20166923.pdf; Avnet Part Number: KINKPG1608CGKCT; Price: 0.0323; MOQ: 4000
R2 R3 = RC0603FR-07150RL: RES 150 OHM 1/10W 1% 0603 SMD; manufacturer: Yageo; currency: USD; Rated Power: 0.1W, 1/10W; smt_res_0603id: 72883; sub_category_id: 619; category_id: 33; Temperature Coefficient: ±100ppm/°C; lead_style: Surface Mount (SMD - SMT); Value Unit: 1; MOQ: 5.000; Part Number: RC0603FR-07150RL; price: 0.00270; image: http://media.digikey.com/Renders/Yageo%20Renders/RC0603FR-0710RL_tmb.jpg; Digikey PN: 311-150HRTR-ND; series: RC0603; composition: Thick Film; features: -; Tolerance: ±1%; Case: 0603 (1608 metric); Size Dimension: 0.063" L x 0.031" W (1.60mm x 0.80mm); Height: 0.018" (0.45mm); packaging: Tape & Reel (TR); quantity_available: 970,000Note / Alternate Packaging; datasheet: http://www.yageo.com/pdf/Pu-RC0603_51_PbFree_L_2.pdf; Normalized Value: 150; Display Value: 150; Value_in_ohm: 150
R5 = RT0603BRE07270RL: as R8 on sheet Power Supply Unit; MOQ: 5.000; Part Number: RT0603BRE07270RL; price: 0.11300; image: http://media.digikey.com/Renders/Yageo%20Renders/RC0603FR-0710RL_tmb.jpg; Digikey PN: RT0603BRE07270RL-ND; series: RT; composition: Thin Film; features: -; Case: 0603 (1608 metric); Size Dimension: 0.063" L x 0.031" W (1.60mm x 0.80mm); Height: 0.018" (0.45mm); packaging: Tape & Reel (TR); quantity_available: 0; datasheet: http://www.yageo.com/pdf/PYu-RT_1-to-0.05_RoHS_L_3.pdf; Normalized Value: 270; Display Value: 270; Value_in_ohm: 270
R12 = RC0603FR-07130RL: RES 130 OHM 1/10W 1% 0603 SMD; manufacturer: Yageo; currency: USD; Rated Power: 0.1W, 1/10W; smt_res_0603id: 142960; sub_category_id: 619; category_id: 33; Temperature Coefficient: ±100ppm/°C; lead_style: Surface Mount (SMD - SMT); Value Unit: 1; MOQ: 5.000; Part Number: RC0603FR-07130RL; price: 0.00270; image: http://media.digikey.com/Renders/Yageo%20Renders/RC0603FR-0710RL_tmb.jpg; Digikey PN: 311-130HRTR-ND; series: RC0603; composition: Thick Film; features: -; Tolerance: ±1%; Case: 0603 (1608 metric); Size Dimension: 0.063" L x 0.031" W (1.60mm x 0.80mm); Height: 0.018" (0.45mm); packaging: Tape & Reel (TR); quantity_available: 0Note / Alternate Packaging; datasheet: http://www.yageo.com/pdf/Pu-RC0603_51_PbFree_L_2.pdf; Normalized Value: 130; Display Value: 130; Value_in_ohm: 130
R15 R16 = RC0603FR-071K6L: RES 1.60K OHM 1/10W 1% 0603 SMD; manufacturer: Yageo; currency: USD; Rated Power: 0.1W, 1/10W; smt_res_0603id: 73222; sub_category_id: 619; category_id: 33; Temperature Coefficient: ±100ppm/°C; lead_style: Surface Mount (SMD - SMT); Value Unit: 1000; Normalized Value: 1.6; Display Value: 1.6K; Value_in_ohm: 1600; MOQ: 5.000; Part Number: RC0603FR-071K6L; price: 0.00270; image: http://media.digikey.com/Renders/Yageo%20Renders/RC0603FR-0710RL_tmb.jpg; Digikey PN: 311-1.60KHRTR-ND; series: RC0603; composition: Thick Film; features: -; Tolerance: ±1%; Case: 0603 (1608 metric); Size Dimension: 0.063" L x 0.031" W (1.60mm x 0.80mm); Height: 0.018" (0.45mm); packaging: Tape & Reel (TR); quantity_available: 0Note / Alternate Packaging; datasheet: http://www.yageo.com/pdf/Pu-RC0603_51_PbFree_L_2.pdf
U4 = ATmega128A-AU: 8-bit AVR Microcontroller, 128KB Flash, 4KB EEPROM, 4KB SRAM, 64-pin TQFP, Industrial Grade (-40°C to 85°C); Published: 1-Apr-2010; DatasheetVersion: revE, Feb-2010; PackageVersion: revB, Oct-2001; PackageReference: 64A; Publisher: Altium Limited; PackageDescription: 64-Pin Plastic Thin Profile Quad Flat Pack, 14 x 14 x 1.0 mm Body, 0.8 mm Pitch (TQFP); Supplier 1: Digi-Key; Supplier Part Number 1: ATMEGA128A-AU-ND; Supplier 2: Farnell; Supplier Part Number 2: 1773397; Supplier 3: Mouser; Supplier Part Number 3: 556-ATMEGA128A-AU; Code_JEDEC: MS-026-AEB; ComponentLink1Description: Manufacturer Link; ComponentLink1URL: http://www.atmel.com/products/avr/default.asp?; ComponentLink2Description: ATmega128A Datasheet; ComponentLink2URL: http://www.atmel.com/dyn/resources/prod_documents/doc8151.pdf; ComponentLink3Description: ATmega128A Summary; ComponentLink3URL: http://www.atmel.com/dyn/resources/prod_documents/8151S.pdf; ComponentLink4Description: Atmel.com Home; ComponentLink4URL: http://www.atmel.com
Y1 = ABM3-8.000MHZ-D2Y-T: 5.0 X 3.2 X 1.3mm Crystal 8MHz, CL 18pF, 20ppm; Manufacturer: Abracon; ESR (Equivalent Series Resistance): 500R; Frequency Stability: 30ppm; currency: EUR; Supplier 1: Digi-Key; Part Number: ABM3-8.000MHZ-D2Y-T; Stock 1: 26000; Price: 0.1441; Mount: Surface Mount; Case/Package: CSMD; Number of Pins: 2; Min Operating Temperature: -40°C; Max Operating Temperature: 85°C; Frequency: 8MHz; Tolerance: 20ppm; Load Capacitance: 18pF; Packaging: Tape and Reel; Package Quantity: 1000; Frequency Tolerance: 20ppm; Termination: SMD/SMT; Composition: Ceramic; Series Resistance: 500R; Length: 5mm; Height: 0.051inch; Width: 3.2mm; Depth: 3.2mm; Radiation Hardening: No; REACH SVHC: Unknown; Lead Free: Lead Free; ComponentLink1URL: https://datasheet.ciiva.com/4945/abm3-47699-4945424.pdf; ComponentLink1Description: https://datasheet.ciiva.com/4945/abm3-47699-4945424.pdf; ComponentLink2URL: https://datasheet.ciiva.com/5788/abm3-5788043.pdf; ComponentLink2Description: https://datasheet.ciiva.com/5788/abm3-5788043.pdf; ComponentLink3URL: https://datasheet.ciiva.com/26812/getdatasheetpartid-723821-26812186.pdf; ComponentLink3Description: https://datasheet.ciiva.com/26812/getdatasheetpartid-723821-26812186.pdf; ComponentLink4URL: https://datasheet.ciiva.com/7998/abm3-7998589.pdf; ComponentLink4Description: https://datasheet.ciiva.com/7998/abm3-7998589.pdf; ComponentLink5URL: https://datasheet.ciiva.com/16392/abm3-16392475.pdf; ComponentLink5Description: https://datasheet.ciiva.com/16392/abm3-16392475.pdf; ComponentLink6URL: https://datasheet.ciiva.com/3174/abm3-3174137.pdf; ComponentLink6Description: https://datasheet.ciiva.com/3174/abm3-3174137.pdf; ComponentLink7URL: https://datasheet.ciiva.com/862/abm3-862466.pdf; ComponentLink7Description: https://datasheet.ciiva.com/862/abm3-862466.pdf; ComponentLink8URL: https://datasheet.ciiva.com/862/abm3-862465.pdf; ComponentLink8Description: https://datasheet.ciiva.com/862/abm3-862465.pdf; ComponentLink9URL: https://datasheet.ciiva.com/1357/1754353-1357270.pdf; ComponentLink9Description: https://datasheet.ciiva.com/1357/1754353-1357270.pdf; ComponentLink10URL: https://datasheet.ciiva.com/862/abm3-862467.pdf; ComponentLink10Description: https://datasheet.ciiva.com/862/abm3-862467.pdf; Avnet Part Number: ABRABM38000MHZD2YT; MOQ: 1000

## Sheet Motor Driver Unit.SchDoc: Motor Driver Unit
size A3; DrawnBy: Adrien Dos SANTOS; Organization: Altium Limited; Revision: REV 1.0; SheetNumber: 3; SheetTotal: 5; ProjectName: projname
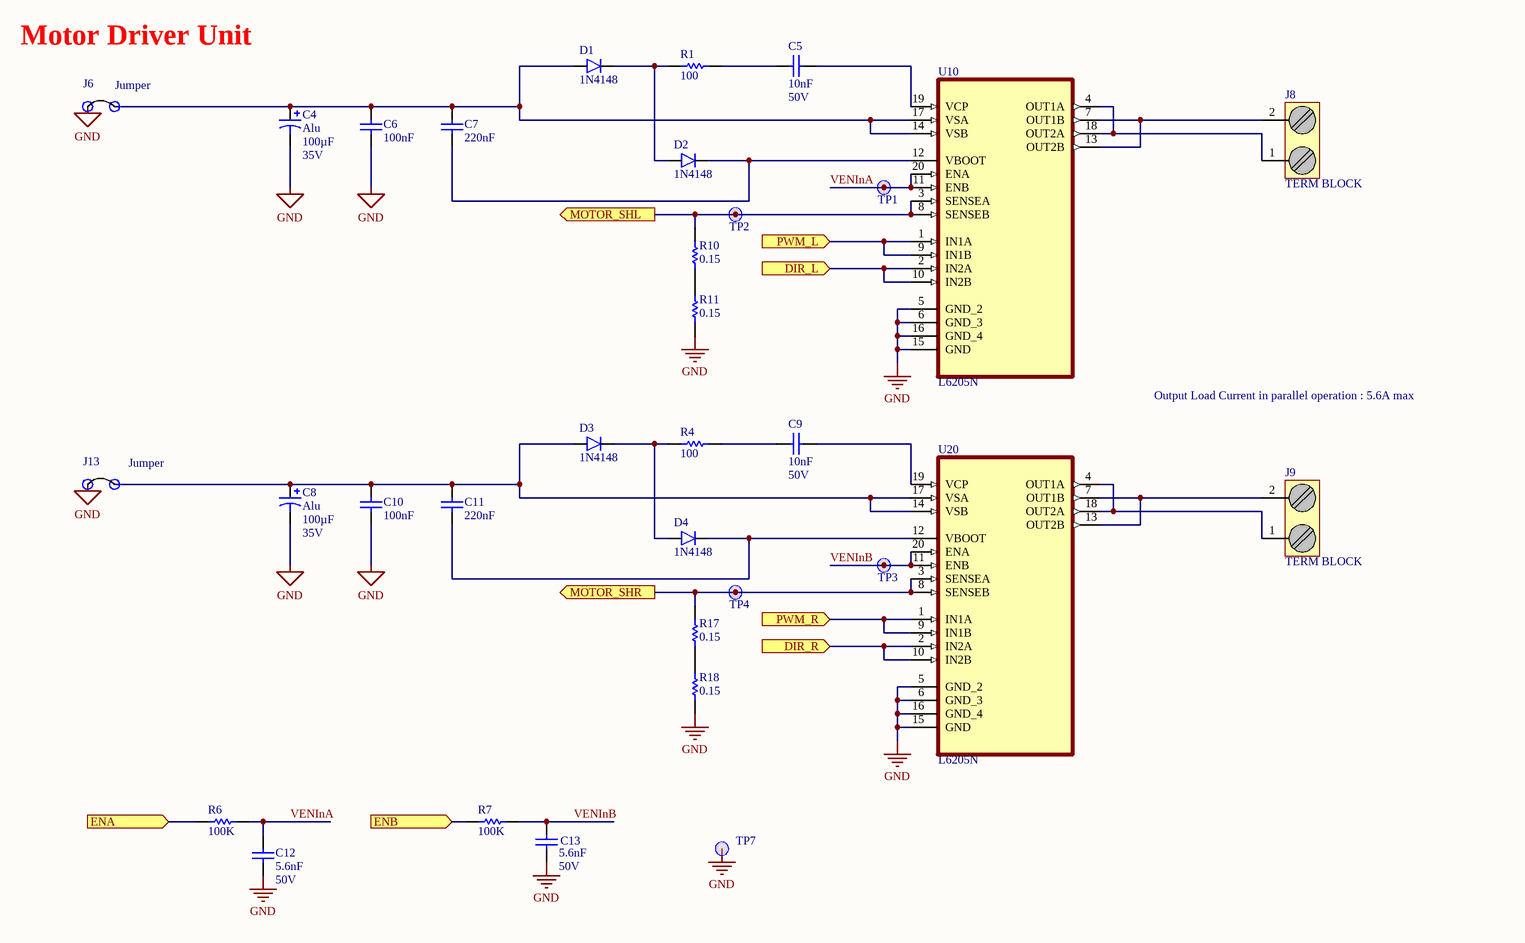
[diagram p4: Motor Driver Unit.SchDoc]

### Parts
C4  Alu  Capacitance: 100µF  Voltage: 35V  [UWT1V101MCL1GS]
C5  value 10nF  Voltage - Rated: 50V  [CC0603 x 0.90mm]  (hidden comment: CAP)
C6  value 100nF  [CC0805 x 0.90mm]  (hidden comment: CAP)
C7  value 220nF  [CC0805 x 0.90mm]  (hidden comment: CAP)
C8  Alu  Capacitance: 100µF  Voltage: 35V  [UWT1V101MCL1GS]
C9  value 10nF  Voltage - Rated: 50V  [CC0603 x 0.90mm]  (hidden comment: CAP)
C10  value 100nF  [CC0805 x 0.90mm]  (hidden comment: CAP)
C11  value 220nF  [CC0603 x 0.9mm]  (hidden comment: CAP)
C12  value 5.6nF  Voltage - Rated: 50V  [CC0603 x 0.90mm]  (hidden comment: CAP)
C13  value 5.6nF  Voltage - Rated: 50V  [CC0603 x 0.90mm]  (hidden comment: CAP)
D1  1N4148  [SOD323]
D2  1N4148  [SOD323]
D3  1N4148  [SOD323]
D4  1N4148  [SOD323]
J6  Jumper  [68002-102HLF]
J8  TERM BLOCK  [282841-2]
J9  TERM BLOCK  [282841-2]
J13  Jumper  [68002-102HLF]
R1  value 100  [RESC0603_N]  (hidden comment: RES)
R4  value 100  [RESC0603_N]  (hidden comment: RES)
R6  value 100K  [RESC0603_N]  (hidden comment: RES)
R7  value 100K  [RESC0603_N]  (hidden comment: RES)
R10  value 0.15  [RESC0603_N]  (hidden comment: RES)
R11  value 0.15  [RESC0603_N]  (hidden comment: RES)
R17  value 0.15  [RESC0603_N]  (hidden comment: RES)
R18  value 0.15  [RESC0603_N]  (hidden comment: RES)
TP1  TEST_POINT_1.27mm  [Test_Point1.27mm]  (value not drawn)  (no BOM)
TP2  TEST_POINT_1.27mm  [Test_Point1.27mm]  (value not drawn)  (no BOM)
TP3  TEST_POINT_1.27mm  [Test_Point1.27mm]  (value not drawn)  (no BOM)
TP4  TEST_POINT_1.27mm  [Test_Point1.27mm]  (value not drawn)  (no BOM)
TP7  TEST_POINT_1.27mm  [Test_Point1.27mm]  (value not drawn)  (no BOM)
U10  L6205N  [DIP254P762X510-20]
U20  L6205N  [DIP254P762X510-20]

### Ports
DIR_L (in), DIR_R (in), ENA (in), ENB (in), MOTOR_SHL (out), MOTOR_SHR (out), PWM_L (in), PWM_R (in)

### Nets
GND: C4.2 C6.1 C8.2 C10.1 C12.1 C13.1 J6.1 J13.1 R11.1 R18.1 TP7.1 U10.5(GND_2) U10.6(GND_3) U10.15(GND) U10.16(GND_4) U20.5(GND_2) U20.6(GND_3) U20.15(GND) U20.16(GND_4)
VENInA: C12.2 R6.1 TP1.1 U10.11(ENB) U10.20(ENA)
VENInB: C13.2 R7.1 TP3.1 U20.11(ENB) U20.20(ENA)
NetC4_1: C4.1 C6.2 C7.2 D1.1(A) J6.2 U10.14(VSB) U10.17(VSA)
NetC5_1: C5.1 R1.2
NetC5_2: C5.2 U10.19(VCP)
NetC7_1: C7.1 D2.2(K) U10.12(VBOOT)
NetC8_1: C8.1 C10.2 C11.2 D3.1(A) J13.2 U20.14(VSB) U20.17(VSA)
NetC9_1: C9.1 R4.2
NetC9_2: C9.2 U20.19(VCP)
NetC11_1: C11.1 D4.2(K) U20.12(VBOOT)
NetD1_2: D1.2(K) D2.1(A) R1.1
NetD3_2: D3.2(K) D4.1(A) R4.1
NetJ8_1: J8.1 U10.4(OUT1A) U10.18(OUT2A)
NetJ8_2: J8.2 U10.7(OUT1B) U10.13(OUT2B)
NetJ9_1: J9.1 U20.4(OUT1A) U20.18(OUT2A)
NetJ9_2: J9.2 U20.7(OUT1B) U20.13(OUT2B)
NetR6_2: R6.2 ; port ENA
NetR7_2: R7.2 ; port ENB
NetR10_1: R10.1 R11.2
NetR10_2: R10.2 TP2.1 U10.3(SENSEA) U10.8(SENSEB) ; port MOTOR_SHL
NetR17_1: R17.1 R18.2
NetR17_2: R17.2 TP4.1 U20.3(SENSEA) U20.8(SENSEB) ; port MOTOR_SHR
NetU4_48: U20.2(IN2A) U20.10(IN2B) ; port DIR_R
NetU4_49: U20.1(IN1A) U20.9(IN1B) ; port PWM_R
NetU4_50: U10.2(IN2A) U10.10(IN2B) ; port DIR_L
NetU4_51: U10.1(IN1A) U10.9(IN1B) ; port PWM_L

### Notes on the sheet
- Motor Driver Unit
- Output Load Current in parallel operation : 5.6A max
- Title
- Size:
- Date:
- A3
- Revision:
- Time:
- Sheet
- of
- Avnet EMG France SA
- 12 rue Jean Bart
- 91120 MASSY - FR
- File:
- Drawn by :

### Library data of the parts
C4 C8 = UWT1V101MCL1GS: CAP ALUM 100UF 20% 35V SMD; Manufacturer: Nichicon; Currency: EUR; Part Number: UWT1V101MCL1GS; Price: 0.0452; MOQ: 18000; Avnet Part Number: NCHUWT1V101MCL1GS
C5 C9 = CC0603KRX7R9BB103: 10000pF ±10% 50V Ceramic Capacitor X7R 0603 (1608 Metric); manufacturer: Yageo; Manufacturer Standard Lead Time: 16 Weeks; currency: USD; idx: 519; Package Inch: 0603; Package Metric: 1608; Normalized value µF: 0.01; Part Number: CC0603KRX7R9BB103; price: *; Rated Voltage: *; Tolerance: ±10%; Temperature Coefficient: X7R; MOQ: *; ComponentLink1URL: https://www.yageo.com/upload/media/product/productsearch/datasheet/mlcc/UPY-GPHC_X7R_6.3V-to-50V_18.pdf; ProductLink: https://www.digikey.com/product-detail/en/yageo/CC0603KRX7R9BB103/311-1085-2-ND/302819; Digi-Key Part Number: 311-1085-2-ND; Operating Temperature: -55°C ~ 125°C; Lead Free Status / RoHS Status: Lead free / ROHS3 Compliant; Mounting Type: Surface Mount, MLCC; Size / Dimension: 0.063" L x 0.031" W (1.60mm x 0.80mm); Thickness (Max): 0.035" (0.90mm); Thickness mm: 0.90; Thickness Inch: 0.035; Length Inch: 0.063; Width Inch: 0.031; Length mm: 1.60; Width mm: 0.80; Series: CC; Part Status: Active; Package / Case: 0603 (1608 Metric); Lead Style: -; Packaging: Tape & Reel (TR); Moisture Sensitivity Level (MSL): 1  (Unlimited); Applications: General Purpose; Height - Seated (Max): -; Lead Spacing: -; Capacitance: 10000pF; Features: -; Ratings: -; Failure Rate: -
C6 C10 = C0805X104KMREC: currency: USD; manufacturer: *; Part Number: *; price: *; Rated Voltage: *; Tolerance: *; Temperature Coefficient: *; MOQ: *
C7 = C0805X224JMREC: currency: USD; manufacturer: *; Part Number: *; price: *; Rated Voltage: *; Tolerance: *; Temperature Coefficient: *; MOQ: *
C11 = CS0603KRX7R8BB224: currency: USD; manufacturer: *; Part Number: *; price: *; Rated Voltage: *; Tolerance: *; Temperature Coefficient: *; MOQ: *
C12 C13 = CC0603JRX7R9BB562: 5600pF ±5% 50V Ceramic Capacitor X7R 0603 (1608 Metric); manufacturer: Yageo; Manufacturer Standard Lead Time: 17 Weeks; currency: USD; idx: 31442; Package Inch: 0603; Package Metric: 1608; Normalized value µF: 0.0056; Part Number: CC0603JRX7R9BB562; price: *; Rated Voltage: *; Tolerance: ±5%; Temperature Coefficient: X7R; MOQ: *; ComponentLink1URL: https://www.yageo.com/upload/media/product/productsearch/datasheet/mlcc/UPY-GPHC_X7R_6.3V-to-50V_18.pdf; ProductLink: https://www.digikey.com/product-detail/en/yageo/CC0603JRX7R9BB562/311-4021-2-ND/5883696; Digi-Key Part Number: 311-4021-2-ND; Operating Temperature: -55°C ~ 125°C; Lead Free Status / RoHS Status: Lead free / ROHS3 Compliant; Mounting Type: Surface Mount, MLCC; Size / Dimension: 0.063" L x 0.031" W (1.60mm x 0.80mm); Thickness (Max): 0.035" (0.90mm); Thickness mm: 0.90; Thickness Inch: 0.035; Length Inch: 0.063; Width Inch: 0.031; Length mm: 1.60; Width mm: 0.80; Series: CC; Part Status: Active; Package / Case: 0603 (1608 Metric); Lead Style: -; Packaging: Tape & Reel (TR); Moisture Sensitivity Level (MSL): 1  (Unlimited); Applications: General Purpose; Height - Seated (Max): -; Lead Spacing: -; Capacitance: 5600pF; Features: -; Ratings: -; Failure Rate: -
D1-D4 = 1N4148WS-7-F: 75V 300mA SURFACE MOUNT FAST SWITCHING DIODE; manufacturer: Diodes Inc.; currency: USD; Part Number: 1N4148WS-7-F; price: 0.02; MOQ: 3000
J6 J13 = 68002-102HLF JMP: as J11 on sheet Power Supply Unit; Supplier 1: Digi-Key; Part Number: 68002-102HLF; RoHS: Yes; Category: Board to Board Connectors; Stock 1: 4863; Pricing 1: 1=0,33000, 10=0,31600, 100=0,22120, 500=0,18964, 1000=0,15803, 5000=0,13545, 10000=0,12642 (USD); Mount: Through Hole; Contact Plating: Gold,GXT; Contact Material: Bronze; Color: Black; Housing Color: Black; Housing Material: Thermoplastic; Min Operating Temperature: -65°C; Max Operating Temperature: 125°C; Number of Rows: 1; Termination: Solder; Packaging: Bulk; Contact Gender: Male; Package Quantity: 100; Number of Positions: 2; Max Voltage Rating (AC): 1.5kV; Orientation: Straight; Length: 5.08mm; Pitch: 2.54mm; Contact Mating Length: 0.23inch; Depth: 2.41mm; Radiation Hardening: No; Lead Free: Lead Free; Flammability Rating: UL94 V-0; ComponentLink1URL: https://datasheet.ciiva.com/16726/68000-16726189.pdf?src-supplier=Avnet+Europe; ComponentLink1Description: https://datasheet.ciiva.com/16726/68000-16726189.pdf?src-supplier=Avnet+Europe; ComponentLink2URL: https://datasheet.ciiva.com/721/68000-721356.pdf?src-supplier=Digi-Key; ComponentLink2Description: https://datasheet.ciiva.com/721/68000-721356.pdf?src-supplier=Digi-Key
J8 J9 = 282841-2: TERM BLOCK 2POS SIDE ENT 5.08MM; Manufacturer: TE Connectivity; currency: USD; Part Number: 282841-2; price: 1.7; MOQ: *
R1 R4 = 9C06031A1000FKHFT: RES 100 OHM 1/10W 1% 0603 SMD; manufacturer: Yageo; currency: USD; Rated Power: 0.1W, 1/10W; smt_res_0603id: 202386; sub_category_id: 619; category_id: 33; Temperature Coefficient: ±100ppm/°C; lead_style: Surface Mount (SMD - SMT); Value Unit: 1; MOQ: 5.000; Part Number: 9C06031A1000FKHFT; price: Call; image: http://media.digikey.com/Photos/NoPhoto/NoPhoto_TMB.jpg; Digikey PN: 311-100HTR-ND; series: RC0603; composition: Thick Film; features: -; Tolerance: ±1%; Case: 0603 (1608 metric); Size Dimension: 0.063" L x 0.031" W (1.60mm x 0.80mm); Height: 0.018" (0.45mm); packaging: Tape & Reel (TR); quantity_available: 0Note; datasheet: http://www.yageo.com/pdf/Pu-RC0603_51_PbFree_L_2.pdf; Normalized Value: 100; Display Value: 100; Value_in_ohm: 100
R6 R7 = RT0603DRE07100KL: RES 100K OHM 1/10W .5% SMD 0603; manufacturer: Yageo; currency: USD; Rated Power: 0.1W, 1/10W; smt_res_0603id: 67727; sub_category_id: 619; category_id: 33; Temperature Coefficient: ±50ppm/°C; Tolerance: ±0.5%; lead_style: Surface Mount (SMD - SMT); Value Unit: 1000; Normalized Value: 100; Value_in_ohm: 100000; MOQ: 15.000; Part Number: RT0603DRE07100KL; price: 0.01200; image: http://media.digikey.com/Renders/Yageo%20Renders/RC0603FR-0710RL_tmb.jpg; Digikey PN: RT0603DRE07100KL-ND; series: RT; composition: Thin Film; features: -; Case: 0603 (1608 metric); Size Dimension: 0.063" L x 0.031" W (1.60mm x 0.80mm); Height: 0.018" (0.45mm); packaging: Tape & Reel (TR); quantity_available: 5,000; datasheet: http://www.yageo.com/pdf/PYu-RT_1-to-0.05_RoHS_L_3.pdf; Display Value: 100K
R10 R11 R17 R18 = RL0603FR-070R15L: RES .15 OHM 1/10W 1% 0603 SMD; manufacturer: Yageo; currency: USD; Rated Power: 0.1W, 1/10W; smt_res_0603id: 43191; sub_category_id: 619; category_id: 33; Temperature Coefficient: ±800ppm/°C; lead_style: Surface Mount (SMD - SMT); Value Unit: 1; Display Value: 150m; MOQ: 5.000; Part Number: RL0603FR-070R15L; price: 0.12700; image: http://media.digikey.com/Renders/Yageo%20Renders/RC0603FR-0710RL_tmb.jpg; Digikey PN: 311-.15QTR-ND; series: RL; composition: Thick Film; features: -; Tolerance: ±1%; Case: 0603 (1608 metric); Size Dimension: 0.063" L x 0.031" W (1.60mm x 0.80mm); Height: 0.018" (0.45mm); packaging: Tape & Reel (TR); quantity_available: 15,000Note / Alternate Packaging; datasheet: http://www.yageo.com/pdf/Pu-RL_51_PbFree_L_1.pdf; Normalized Value: 0.15; Value_in_ohm: 0.15
U10 U20 = L6205N: L6205N DIP Half H-Bridge Driver _Internal FET_ Power Management Evaluation Board; MF: STMicroelectronics; Price: None; SnapEDA_Link: https://www.snapeda.com/parts/L6205N/STMicroelectronics/view-part/41353/?ref=snap; MP: L6205N; Availability: Unavailable; Value: *; Package: DIP-20 STMicroelectronics

## Nets that join several sheets
+5V: Power Supply Unit (6 pins), USB Control Unit (LED5.2 LED6.2), Micro-Controller Unit (16 pins)
GND: Power Supply Unit (13 pins), USB Control Unit (12 pins), Micro-Controller Unit (30 pins), Motor Driver Unit (19 pins)
NetR6_2: Micro-Controller Unit (U4.6), Motor Driver Unit (R6.2)
NetR7_2: Micro-Controller Unit (U4.7), Motor Driver Unit (R7.2)
NetR10_2: Micro-Controller Unit (U4.58), Motor Driver Unit (R10.2 TP2.1 U10.3 U10.8)
NetR17_2: Micro-Controller Unit (U4.59), Motor Driver Unit (R17.2 TP4.1 U20.3 U20.8)
NetU3_1: USB Control Unit (U3.1), Micro-Controller Unit (U4.28)
NetU3_5: USB Control Unit (U3.5), Micro-Controller Unit (U4.27)
NetU4_48: Micro-Controller Unit (U4.48), Motor Driver Unit (U20.2 U20.10)
NetU4_49: Micro-Controller Unit (U4.49), Motor Driver Unit (U20.1 U20.9)
NetU4_50: Micro-Controller Unit (U4.50), Motor Driver Unit (U10.2 U10.10)
NetU4_51: Micro-Controller Unit (U4.51), Motor Driver Unit (U10.1 U10.9)